# EAGLE schematic ACE1 (EAGLE 9.4.0)
Jupiter ACE Schematic drerived from Bobo Wensel with minor alterations and fixed V1.0 no edge connectors.
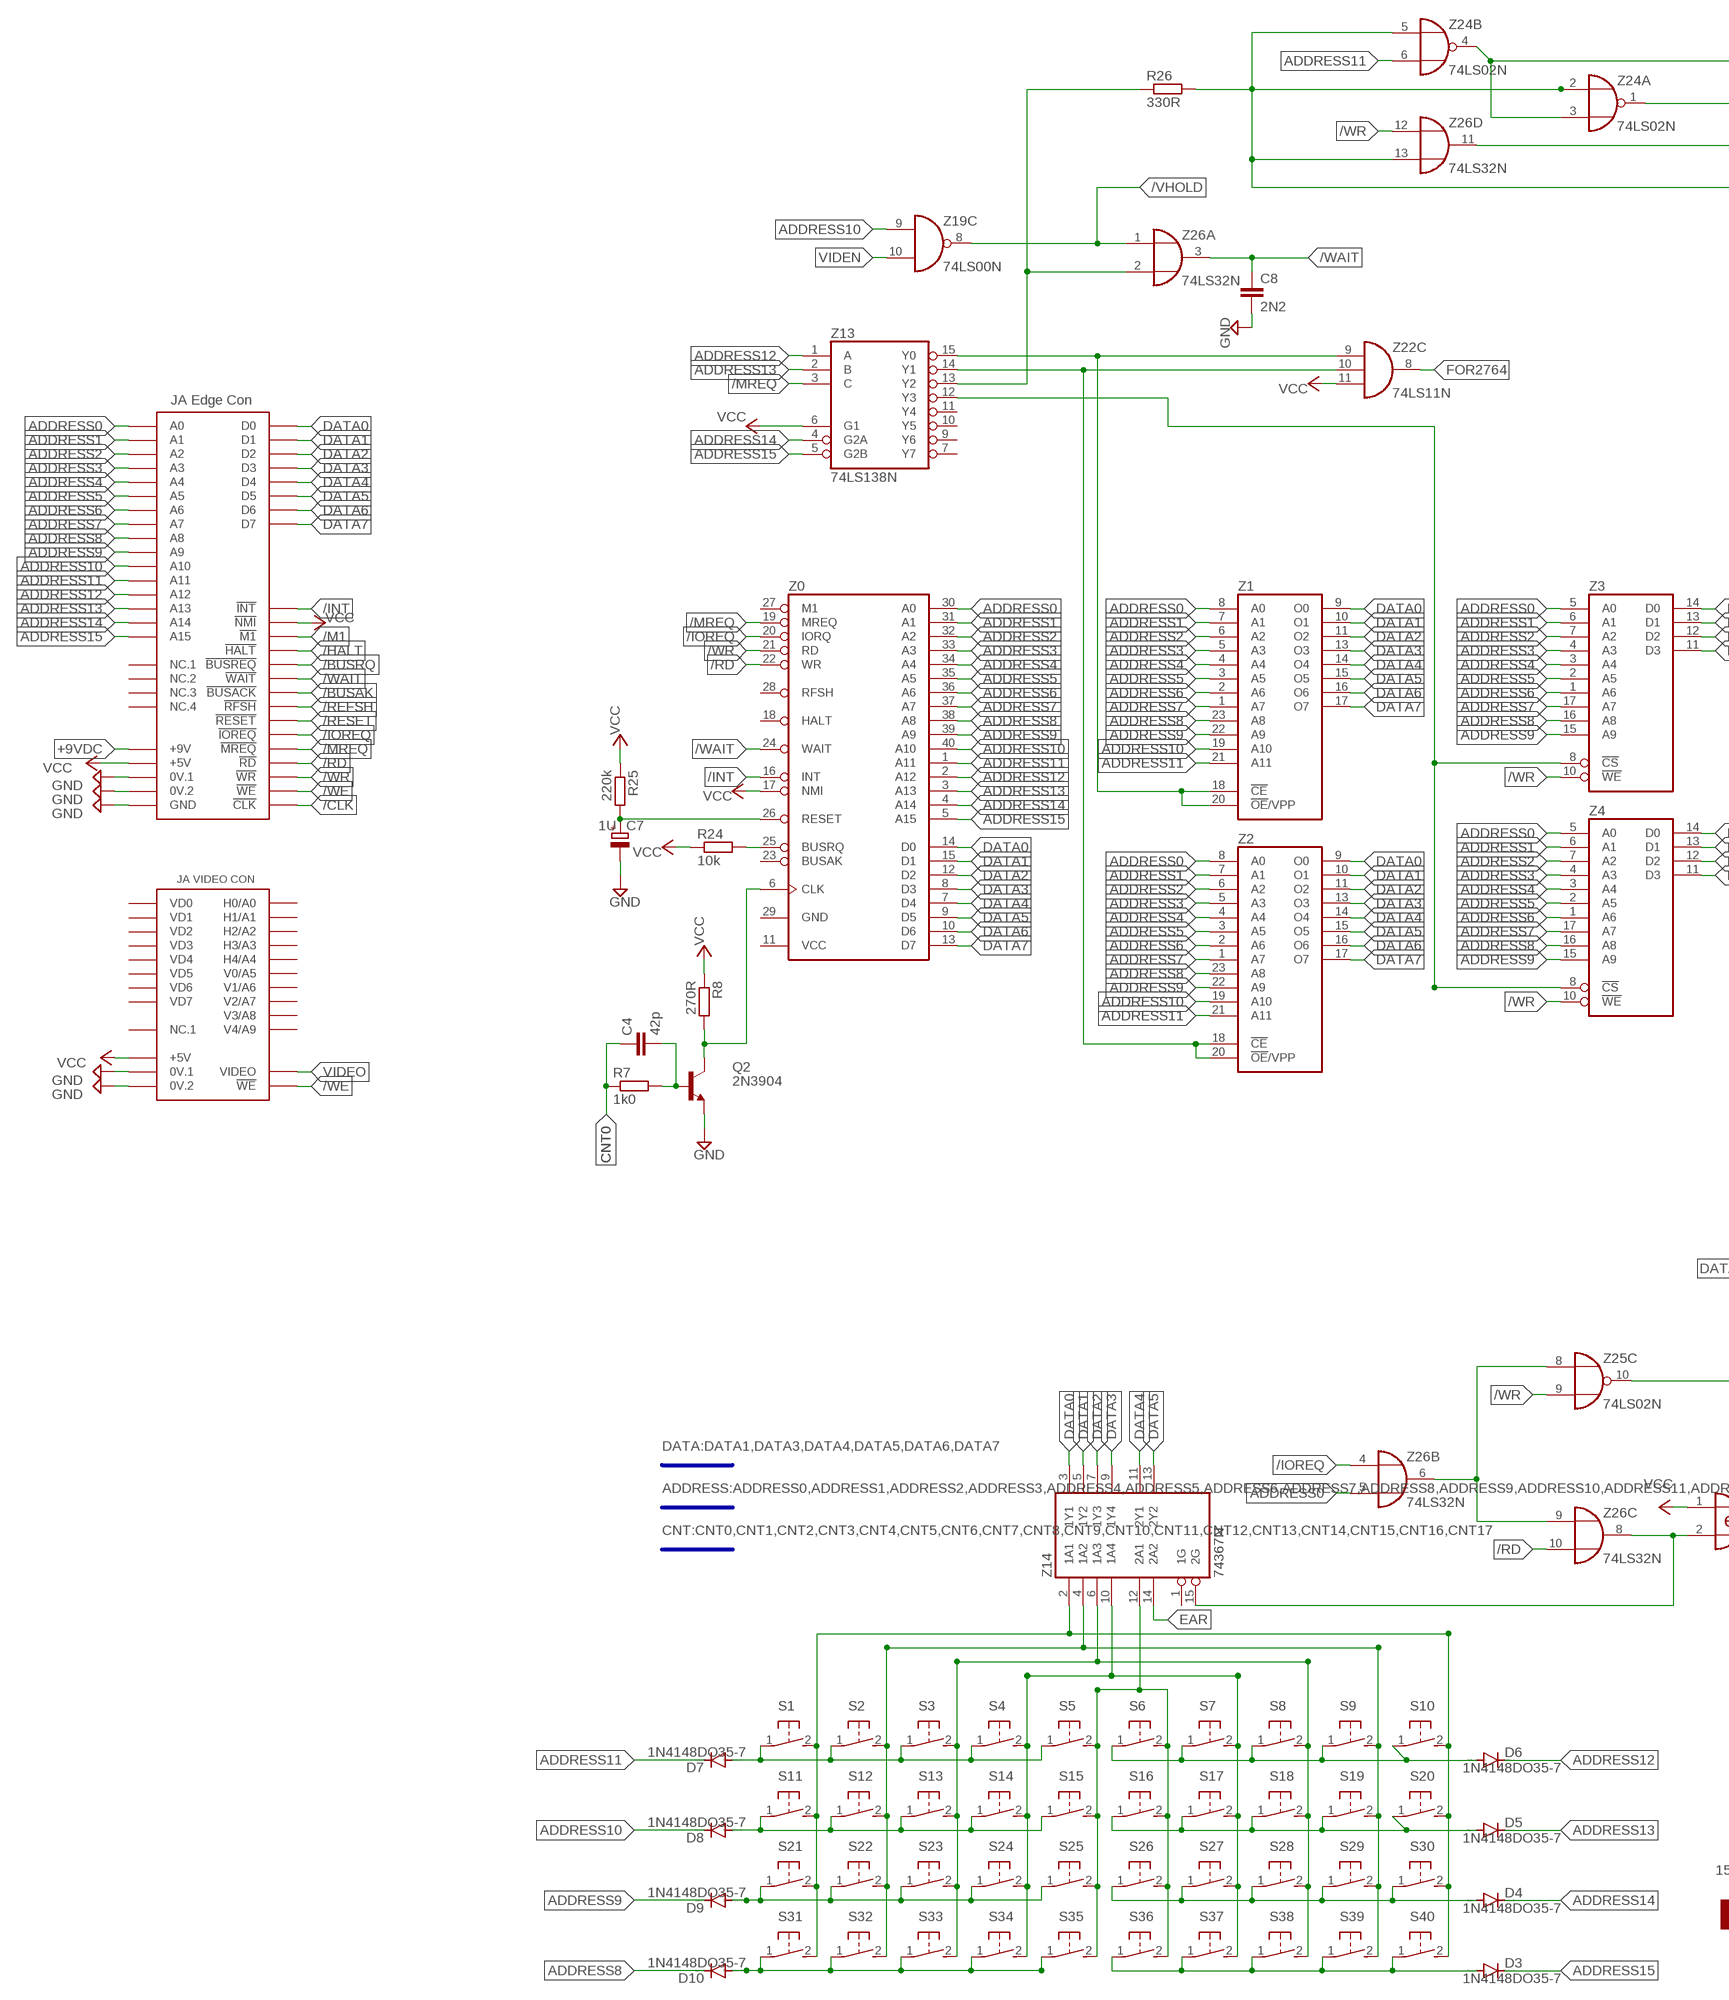
[diagram p0: schematic, sheet 1, part 1 of 2]
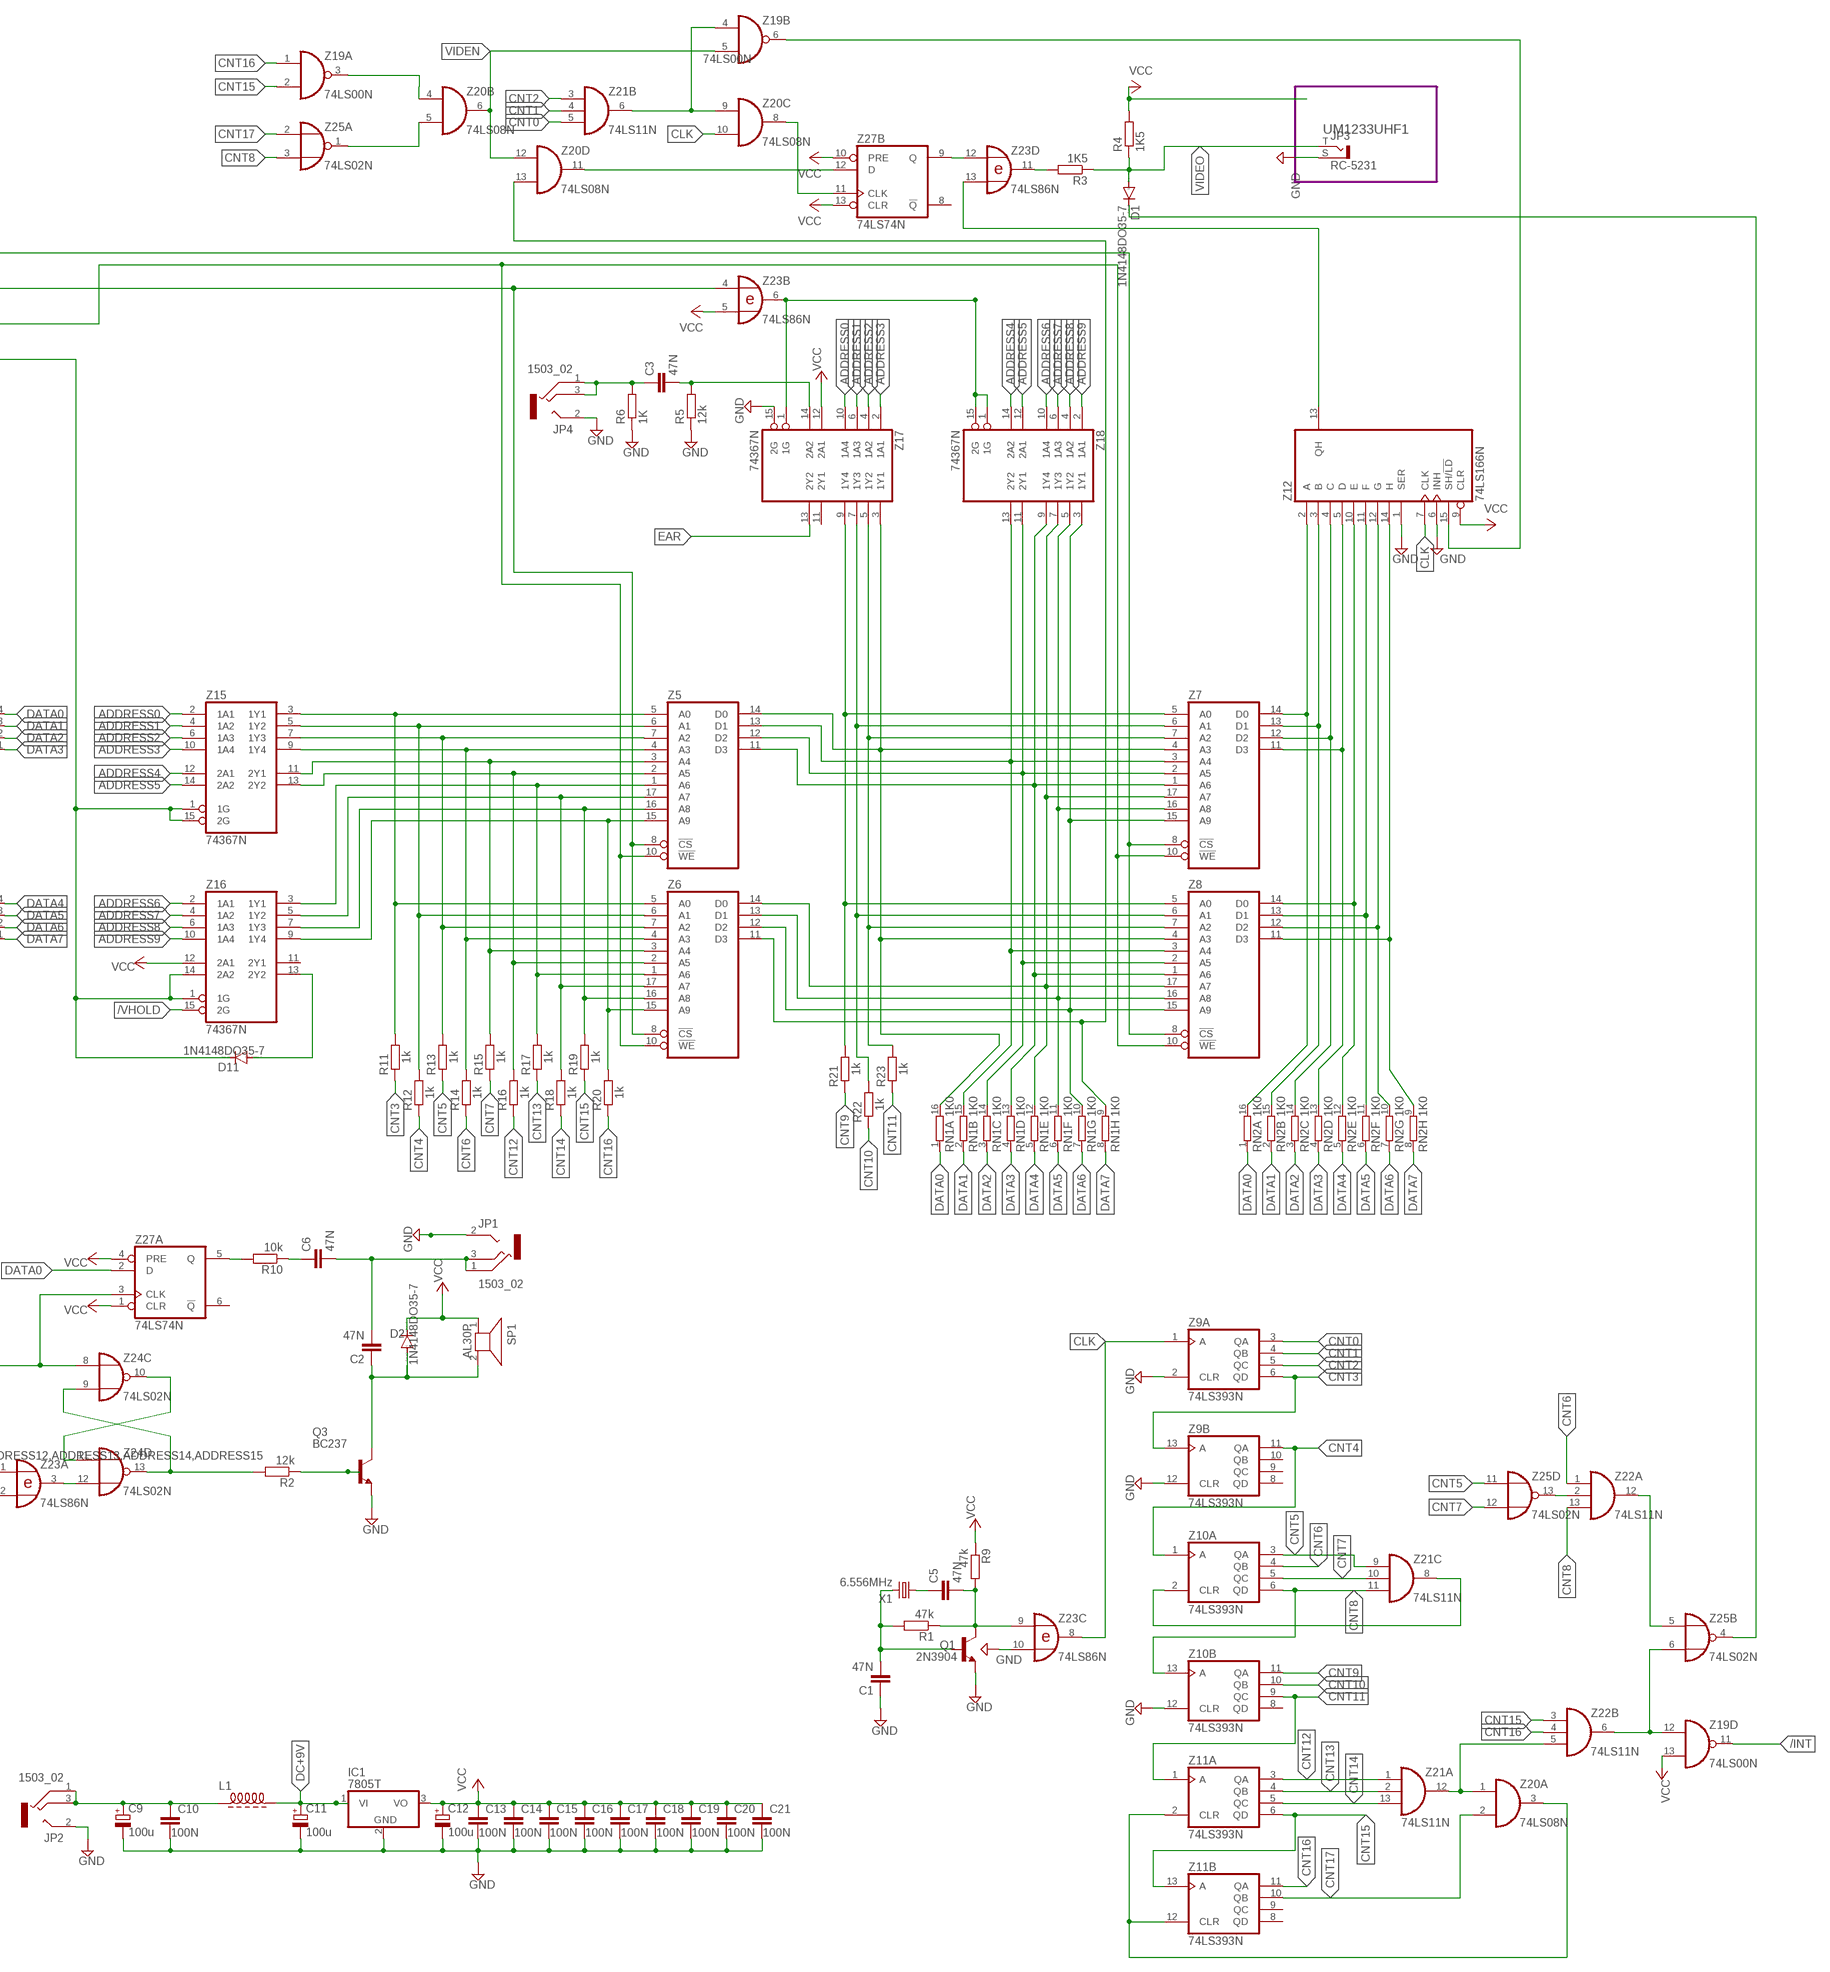
[diagram p1: schematic, sheet 1, part 2 of 2]

## Parts
C1  47N  C-EU025-024X044  [C025-024X044]
C2  47N  C-EU025-024X044  [C025-024X044]
C3  47N  C-EU025-024X044  [C025-024X044]
C4  42p  C-EU025-024X044  [C025-024X044]
C5  47N  C-EU025-024X044  [C025-024X044]
C6  47N  C-EU025-024X044  [C025-024X044]
C7  1U  CPOL-EUE5-5  [E5-5]
C8  2N2  C-EU025-024X044  [C025-024X044]
C9  100u  CPOL-EUE5-5  [E5-5]
C10  100N  C-EU025-024X044  [C025-024X044]
C11  100u  CPOL-EUE5-5  [E5-5]
C12  100u  CPOL-EUE5-5  [E5-5]
C13  100N  C-EU025-024X044  [C025-024X044]
C14  100N  C-EU025-024X044  [C025-024X044]
C15  100N  C-EU025-024X044  [C025-024X044]
C16  100N  C-EU025-024X044  [C025-024X044]
C17  100N  C-EU025-024X044  [C025-024X044]
C18  100N  C-EU025-024X044  [C025-024X044]
C19  100N  C-EU025-024X044  [C025-024X044]
C20  100N  C-EU025-024X044  [C025-024X044]
C21  100N  C-EU025-024X044  [C025-024X044]
D1  1N4148DO35-7  [DO35-7]
D2  1N4148DO35-7  [DO35-7]
D3  1N4148DO35-7  [DO35-7]
D4  1N4148DO35-7  [DO35-7]
D5  1N4148DO35-7  [DO35-7]
D6  1N4148DO35-7  [DO35-7]
D7  1N4148DO35-7  [DO35-7]
D8  1N4148DO35-7  [DO35-7]
D9  1N4148DO35-7  [DO35-7]
D10  1N4148DO35-7  [DO35-7]
D11  1N4148DO35-7  [DO35-7]
E1  EDG-CON-JA  [EDG-CON-JA]
E2  EDG-VID-JA  [EDG-VID-JA]
IC1  7805T  [TO220H]
JP1  1503_02  [1503_02]
JP2  1503_02  [1503_02]
JP3  RC-5231  [RC-5231]
JP4  1503_02  [1503_02]
L1  Z14/40CCW  [Z15/4]
Q1  2N3904  [TO92]
Q2  2N3904  [TO92]
Q3  BC237  [TO92]
R1  47k  R-EU_0207/2V  [0207/2V]
R2  12k  R-EU_0207/2V  [0207/2V]
R3  1K5  R-EU_0207/2V  [0207/2V]
R4  1K5  R-EU_0207/2V  [0207/2V]
R5  12k  R-EU_0207/2V  [0207/2V]
R6  1K  R-EU_0207/2V  [0207/2V]
R7  1k0  R-EU_0204/7  [0204/7]
R8  270R  R-EU_0207/2V  [0207/2V]
R9  47k  R-EU_0207/2V  [0207/2V]
R10  10k  R-EU_0207/2V  [0207/2V]
R11  1k  R-EU_0207/2V  [0207/2V]
R12  1k  R-EU_0207/2V  [0207/2V]
R13  1k  R-EU_0207/2V  [0207/2V]
R14  1k  R-EU_0207/2V  [0207/2V]
R15  1k  R-EU_0207/2V  [0207/2V]
R16  1k  R-EU_0207/2V  [0207/2V]
R17  1k  R-EU_0207/2V  [0207/2V]
R18  1k  R-EU_0207/2V  [0207/2V]
R19  1k  R-EU_0207/2V  [0207/2V]
R20  1k  R-EU_0207/2V  [0207/2V]
R21  1k  R-EU_0207/2V  [0207/2V]
R22  1k  R-EU_0207/2V  [0207/2V]
R23  1k  R-EU_0207/2V  [0207/2V]
R24  10k  R-EU_0207/2V  [0207/2V]
R25  220k  R-EU_0207/2V  [0207/2V]
R26  330R  R-EU_0204/7  [0204/7]
RN1  1K0  8R-N  [DIL16]
RN2  1K0  8R-N  [DIL16]
S1  31-XX  [B3F-31XX]
S2  31-XX  [B3F-31XX]
S3  31-XX  [B3F-31XX]
S4  31-XX  [B3F-31XX]
S5  31-XX  [B3F-31XX]
S6  31-XX  [B3F-31XX]
S7  31-XX  [B3F-31XX]
S8  31-XX  [B3F-31XX]
S9  31-XX  [B3F-31XX]
S10  31-XX  [B3F-31XX]
S11  31-XX  [B3F-31XX]
S12  31-XX  [B3F-31XX]
S13  31-XX  [B3F-31XX]
S14  31-XX  [B3F-31XX]
S15  31-XX  [B3F-31XX]
S16  31-XX  [B3F-31XX]
S17  31-XX  [B3F-31XX]
S18  31-XX  [B3F-31XX]
S19  31-XX  [B3F-31XX]
S20  31-XX  [B3F-31XX]
S21  31-XX  [B3F-31XX]
S22  31-XX  [B3F-31XX]
S23  31-XX  [B3F-31XX]
S24  31-XX  [B3F-31XX]
S25  31-XX  [B3F-31XX]
S26  31-XX  [B3F-31XX]
S27  31-XX  [B3F-31XX]
S28  31-XX  [B3F-31XX]
S29  31-XX  [B3F-31XX]
S30  31-XX  [B3F-31XX]
S31  31-XX  [B3F-31XX]
S32  31-XX  [B3F-31XX]
S33  31-XX  [B3F-31XX]
S34  31-XX  [B3F-31XX]
S35  31-XX  [B3F-31XX]
S36  31-XX  [B3F-31XX]
S37  31-XX  [B3F-31XX]
S38  31-XX  [B3F-31XX]
S39  31-XX  [B3F-31XX]
S40  31-XX  [B3F-31XX]
SP1  AL30P  [AL30P]
X1  6.556MHz  CRYSTALHC49U-V  [HC49U-V]
Z0  Z80CPU  [DIL40]
Z1  2732  [DIL24]
Z2  2732  [DIL24]
Z3  2114  [DIL18]
Z4  2114  [DIL18]
Z5  2114  [DIL18]
Z6  2114  [DIL18]
Z7  2114  [DIL18]
Z8  2114  [DIL18]
Z9  74LS393N  [DIL14]
Z10  74LS393N  [DIL14]
Z11  74LS393N  [DIL14]
Z12  74LS166N  [DIL16]
Z13  74LS138N  [DIL16]
Z14  74367N  [DIL16]
Z15  74367N  [DIL16]
Z16  74367N  [DIL16]
Z17  74367N  [DIL16]
Z18  74367N  [DIL16]
Z19  74LS00N  [DIL14]
Z20  74LS08N  [DIL14]
Z21  74LS11N  [DIL14]
Z22  74LS11N  [DIL14]
Z23  74LS86N  [DIL14]
Z24  74LS02N  [DIL14]
Z25  74LS02N  [DIL14]
Z26  74LS32N  [DIL14]
Z27  74LS74N  [DIL14]

## Module instances
UM1233UHF1 = UM1233UHF

## Nets
+9VDC: E1.+9V
/BUSAK: E1.BUSACK(!BUSACK)
/BUSRQ: E1.BUSREQ(!BUSREQ)
/CLK: E1.CLK(!CLK)
/HALT: E1.HALT(!HALT)
/INT: E1.INT(!INT) Z0.16(INT) Z19.11(D:O)
/IOREQ: E1.IOREQ(!IOREQ) Z0.20(IORQ) Z26.4(B:I0)
/M1: E1.M1(!M1)
/MREQ: E1.MREQ(!MREQ) Z0.19(MREQ) Z13.3(C)
/RD: E1.RD(!RD) Z0.22(WR) Z26.10(C:I1)
/REFSH: E1.RFSH(!RFSH)
/RESET: E1.RESET(!RESET)
/VHOLD: Z16.15(2G) Z19.8(C:O) Z26.1(A:I0)
/WAIT: C8.1 E1.WAIT(!WAIT) Z0.24(WAIT) Z26.3(A:O)
/WE: E1.WE(!WE) E2.WE(!WE!)
/WR: E1.WR(!WR) Z0.21(RD) Z3.10(!WE) Z4.10(!WE) Z25.9(C:I1) Z26.12(D:I0)
ADDRESS0: E1.A0 Z0.30(A0) Z1.8(A0) Z2.8(A0) Z3.5(A0) Z4.5(A0) Z15.2(1A1) Z17.10(1A4) Z26.5(B:I1)
ADDRESS1: E1.A1 Z0.31(A1) Z1.7(A1) Z2.7(A1) Z3.6(A1) Z4.6(A1) Z15.4(1A2) Z17.6(1A3)
ADDRESS2: E1.A2 Z0.32(A2) Z1.6(A2) Z2.6(A2) Z3.7(A2) Z4.7(A2) Z15.6(1A3) Z17.4(1A2)
ADDRESS3: E1.A3 Z0.33(A3) Z1.5(A3) Z2.5(A3) Z3.4(A3) Z4.4(A3) Z15.10(1A4) Z17.2(1A1)
ADDRESS4: E1.A4 Z0.34(A4) Z1.4(A4) Z2.4(A4) Z3.3(A4) Z4.3(A4) Z15.12(2A1) Z18.14(2A2)
ADDRESS5: E1.A5 Z0.35(A5) Z1.3(A5) Z2.3(A5) Z3.2(A5) Z4.2(A5) Z15.14(2A2) Z18.12(2A1)
ADDRESS6: E1.A6 Z0.36(A6) Z1.2(A6) Z2.2(A6) Z3.1(A6) Z4.1(A6) Z16.2(1A1) Z18.10(1A4)
ADDRESS7: E1.A7 Z0.37(A7) Z1.1(A7) Z2.1(A7) Z3.17(A7) Z4.17(A7) Z16.4(1A2) Z18.6(1A3)
ADDRESS8: D10.C E1.A8 Z0.38(A8) Z1.23(A8) Z2.23(A8) Z3.16(A8) Z4.16(A8) Z16.6(1A3) Z18.4(1A2)
ADDRESS9: D9.C E1.A9 Z0.39(A9) Z1.22(A9) Z2.22(A9) Z3.15(A9) Z4.15(A9) Z16.10(1A4) Z18.2(1A1)
ADDRESS10: D8.C E1.A10 Z0.40(A10) Z1.19(A10) Z2.19(A10) Z19.9(C:I0)
ADDRESS11: D7.C E1.A11 Z0.1(A11) Z1.21(A11) Z2.21(A11) Z24.6(B:I1)
ADDRESS12: D6.C E1.A12 Z0.2(A12) Z13.1(A)
ADDRESS13: D5.C E1.A13 Z0.3(A13) Z13.2(B)
ADDRESS14: D4.C E1.A14 Z0.4(A14) Z13.4(G2A)
ADDRESS15: D3.C E1.A15 Z0.5(A15) Z13.5(G2B)
CLK: Z9.1(A:A) Z12.7(CLK) Z20.10(C:I1) Z23.8(C:O)
CNT0: C4.1 R7.1 Z9.3(A:QA) Z21.5(B:I2)
CNT1: Z9.4(A:QB) Z21.4(B:I1)
CNT2: Z9.5(A:QC) Z21.3(B:I0)
CNT3: R11.1 Z9.6(A:QD) Z9.13(B:A)
CNT4: R12.1 Z9.11(B:QA) Z10.1(A:A)
CNT5: R13.1 Z10.3(A:QA) Z21.9(C:I0) Z25.11(D:I0)
CNT6: R14.1 Z10.4(A:QB) Z22.1(A:I0)
CNT7: R15.1 Z10.5(A:QC) Z21.10(C:I1) Z25.12(D:I1)
CNT8: Z10.6(A:QD) Z10.13(B:A) Z21.11(C:I2) Z22.13(A:I2) Z25.3(A:I1)
CNT9: R21.1 Z10.11(B:QA)
CNT10: R22.1 Z10.10(B:QB)
CNT11: R23.1 Z10.9(B:QC) Z11.1(A:A)
CNT12: R16.1 Z11.3(A:QA) Z21.1(A:I0)
CNT13: R17.1 Z11.4(A:QB) Z21.2(A:I1)
CNT14: R18.1 Z11.5(A:QC) Z21.13(A:I2)
CNT15: R19.1 Z11.6(A:QD) Z11.13(B:A) Z19.2(A:I1) Z22.3(B:I0)
CNT16: R20.1 Z11.11(B:QA) Z19.1(A:I0) Z22.4(B:I1)
CNT17: Z11.10(B:QB) Z20.2(A:I1) Z25.2(A:I0)
DATA0: E1.D0 RN1.1 RN2.1 Z0.14(D0) Z1.9(O0) Z2.9(O0) Z3.14(D0) Z14.3(1Y1) Z27.2(A:D)
DATA1: E1.D1 RN1.2 RN2.2 Z0.15(D1) Z1.10(O1) Z2.10(O1) Z3.13(D1) Z14.5(1Y2)
DATA2: E1.D2 RN1.3 RN2.3 Z0.12(D2) Z1.11(O2) Z2.11(O2) Z3.12(D2) Z14.7(1Y3)
DATA3: E1.D3 RN1.4 RN2.4 Z0.8(D3) Z1.13(O3) Z2.13(O3) Z3.11(D3) Z14.9(1Y4)
DATA4: E1.D4 RN1.5 RN2.5 Z0.7(D4) Z1.14(O4) Z2.14(O4) Z4.14(D0) Z14.11(2Y1)
DATA5: E1.D5 RN1.6 RN2.6 Z0.9(D5) Z1.15(O5) Z2.15(O5) Z4.13(D1) Z14.13(2Y2)
DATA6: E1.D6 RN1.7 RN2.7 Z0.10(D6) Z1.16(O6) Z2.16(O6) Z4.12(D2)
DATA7: E1.D7 RN1.8 RN2.8 Z0.13(D7) Z1.17(O7) Z2.17(O7) Z4.11(D3)
DC+9V: C11.+ IC1.1(VI) L1.2
EAR: Z14.14(2A2) Z17.13(2Y2)
FOR2764: Z22.8(C:O)
GND: C1.1 C7.- C8.2 C9.- C10.1 C11.- C12.- C13.1 C14.1 C15.1 C16.1 C17.1 C18.1 C19.1 C20.1 C21.1 E1.0V.1 E1.GND E1.V0.2(0V.2) E2.0V.1 E2.0V.2 IC1.2(GND) JP1.2 JP2.2 JP3.S JP4.2 Q1.3(E) Q2.3(E) Q3.1(E) R5.1 R6.1 Z9.2(A:CLR) Z9.12(B:CLR) Z10.12(B:CLR) Z12.1(SER) Z12.6(INH) Z17.15(2G) Z23.10(C:I1)
N$1: Z1.18(!CE) Z1.20(!OE!/VPP) Z13.15(Y0) Z22.9(C:I0)
N$2: R26.1 Z13.13(Y2) Z26.2(A:I1)
N$3: Z2.18(!CE) Z2.20(!OE!/VPP) Z13.14(Y1) Z22.10(C:I1)
N$4: C3.2 R5.2 Z17.14(2A2)
N$5: R11.2 Z5.5(A0) Z6.5(A0) Z15.3(1Y1)
N$6: Z7.8(!CS) Z8.8(!CS) Z24.3(A:I1) Z24.4(B:O)
N$7: Z5.8(!CS) Z6.8(!CS) Z23.4(B:I0) Z24.1(A:O)
N$8: Z5.10(!WE) Z6.10(!WE) Z7.10(!WE) Z8.10(!WE) Z26.11(D:O)
N$9: Z14.1(1G)
N$10: Z19.3(A:O) Z20.4(B:I0)
N$11: Z20.5(B:I1) Z25.1(A:O)
N$12: C3.1 JP4.1 JP4.3 R6.2
N$13: R12.2 Z5.6(A1) Z6.6(A1) Z15.5(1Y2)
N$14: Z20.11(D:O) Z27.12(B:D)
N$15: Z20.8(C:O) Z27.11(B:CLK)
N$17: Z23.12(D:I0) Z27.9(B:Q)
N$18: Z12.13(QH) Z23.13(D:I1)
N$19: R3.2 Z23.11(D:O)
N$21: Z17.1(1G) Z18.1(1G) Z18.15(2G) Z23.6(B:O)
N$22: Z12.15(SH/!LD) Z19.6(B:O)
N$23: C7.+ R25.2 Z0.26(RESET)
N$24: Q2.1(C) R8.2 Z0.6(CLK)
N$25: R24.2 Z0.25(BUSRQ)
N$26: C4.2 Q2.2(B) R7.2
N$27: Z19.4(B:I0) Z20.9(C:I0) Z21.6(B:O)
N$28: Z3.8(!CS) Z4.8(!CS) Z13.12(Y3)
N$29: Z14.15(2G) Z23.2(A:I1) Z26.8(C:O)
N$30: R13.2 Z5.7(A2) Z6.7(A2) Z15.7(1Y3)
N$31: Z25.8(C:I0) Z26.6(B:O) Z26.9(C:I0)
N$32: R14.2 Z5.4(A3) Z6.4(A3) Z15.9(1Y4)
N$33: C5.2 Q1.1(C) R1.1 R9.2 Z23.9(C:I0)
N$34: Z24.10(C:O) Z24.11(D:I0)
N$35: Z24.8(C:I0) Z25.10(C:O) Z27.3(A:CLK)
N$36: C5.1 X1.1
N$37: R15.2 Z5.3(A4) Z6.3(A4) Z15.11(2Y1)
N$38: R2.2 Z24.9(C:I1) Z24.13(D:O)
N$39: Z23.3(A:O) Z24.12(D:I1)
N$40: Q3.2(B) R2.1
N$41: R10.2 Z27.5(A:Q)
N$42: C6.1 R10.1
N$43: C2.2 C6.2 JP1.1 JP1.3
N$44: C2.1 D2.A Q3.3(C) SP1.2
N$45: R16.2 Z5.2(A5) Z6.2(A5) Z15.13(2Y2)
N$46: R17.2 Z5.1(A6) Z6.1(A6) Z16.3(1Y1)
N$47: C1.2 Q1.2(B) R1.2 X1.2
N$48: R18.2 Z5.17(A7) Z6.17(A7) Z16.5(1Y2)
N$49: Z20.1(A:I0) Z21.12(A:O) Z22.5(B:I2)
N$50: Z19.12(D:I0) Z22.6(B:O) Z25.6(B:I1)
N$51: D1.C Z25.4(B:O)
N$52: Z22.2(A:I1) Z25.13(D:O)
N$53: D7.A S1.1(P) S2.1(P) S3.1(P) S4.1(P) S5.1(P)
N$54: Z10.2(A:CLR) Z21.8(C:O)
N$55: Z11.2(A:CLR) Z11.12(B:CLR) Z20.3(A:O)
N$56: S1.2(S) S10.2(S) S11.2(S) S20.2(S) S21.2(S) S30.2(S) S31.2(S) S40.2(S) Z14.2(1A1)
N$57: D8.A S11.1(P) S12.1(P) S13.1(P) S14.1(P) S15.1(P)
N$58: D9.A S21.1(P) S22.1(P) S23.1(P) S24.1(P) S25.1(P)
N$59: Z22.12(A:O) Z25.5(B:I0)
N$60: D10.A S31.1(P) S32.1(P) S33.1(P) S34.1(P) S35.1(P)
N$61: S3.2(S) S8.2(S) S13.2(S) S18.2(S) S23.2(S) S28.2(S) S33.2(S) S38.2(S) Z14.6(1A3)
N$62: S4.2(S) S7.2(S) S14.2(S) S17.2(S) S24.2(S) S27.2(S) S34.2(S) S37.2(S) Z14.10(1A4)
N$63: S2.2(S) S9.2(S) S12.2(S) S19.2(S) S22.2(S) S29.2(S) S32.2(S) S39.2(S) Z14.4(1A2)
N$64: S5.2(S) S6.2(S) S15.2(S) S16.2(S) S25.2(S) S26.2(S) S35.2(S) S36.2(S) Z14.12(2A1)
N$65: C9.+ C10.2 JP2.1 JP2.3 L1.1
N$67: R19.2 Z5.16(A8) Z6.16(A8) Z16.7(1Y3)
N$68: R20.2 Z5.15(A9) Z6.15(A9) Z16.9(1Y4)
N$69: D11.A Z16.13(2Y2)
N$70: RN1.9 Z6.11(D3) Z20.13(D:I1)
N$71: R21.2 Z7.5(A0) Z8.5(A0) Z17.9(1Y4)
N$73: R22.2 Z7.6(A1) Z8.6(A1) Z17.7(1Y3)
N$74: R23.2 Z7.7(A2) Z8.7(A2) Z17.5(1Y2)
N$75: RN1.16 Z5.14(D0) Z7.4(A3) Z8.4(A3) Z17.3(1Y1)
N$76: RN1.15 Z5.13(D1) Z7.3(A4) Z8.3(A4) Z18.13(2Y2)
N$77: D6.A S6.1(P) S7.1(P) S8.1(P) S9.1(P) S10.1(P)
N$78: D5.A S16.1(P) S17.1(P) S18.1(P) S19.1(P) S20.1(P)
N$79: D4.A S26.1(P) S27.1(P) S28.1(P) S29.1(P) S30.1(P)
N$80: D3.A S36.1(P) S37.1(P) S38.1(P) S39.1(P) S40.1(P)
N$81: RN1.14 Z5.12(D2) Z7.2(A5) Z8.2(A5) Z18.11(2Y1)
N$82: RN1.13 Z5.11(D3) Z7.1(A6) Z8.1(A6) Z18.9(1Y4)
N$83: RN1.12 Z6.14(D0) Z7.17(A7) Z8.17(A7) Z18.7(1Y3)
N$84: RN1.11 Z6.13(D1) Z7.16(A8) Z8.16(A8) Z18.5(1Y2)
N$85: RN1.10 Z6.12(D2) Z7.15(A9) Z8.15(A9) Z18.3(1Y1)
N$86: D11.C R26.2 Z15.1(1G) Z15.15(2G) Z16.1(1G) Z16.14(2A2) Z24.2(A:I0) Z24.5(B:I0) Z26.13(D:I1)
N$90: RN2.9 Z8.11(D3) Z12.14(H)
N$91: RN2.16 Z7.14(D0) Z12.2(A)
N$92: RN2.15 Z7.13(D1) Z12.3(B)
N$93: RN2.14 Z7.12(D2) Z12.4(C)
N$94: RN2.13 Z7.11(D3) Z12.5(D)
N$95: RN2.12 Z8.14(D0) Z12.10(E)
N$96: RN2.11 Z8.13(D1) Z12.11(F)
N$97: RN2.10 Z8.12(D2) Z12.12(G)
VCC: C12.+ C13.2 C14.2 C15.2 C16.2 C17.2 C18.2 C19.2 C20.2 C21.2 D2.C E1.+5V E1.NMI(!NMI) E2.+5V IC1.3(VO) R4.2 R8.1 R9.1 R24.1 R25.1 SP1.1 Z0.17(NMI) Z12.9(CLR) Z13.6(G1) Z16.12(2A1) Z17.12(2A1) Z19.13(D:I1) Z22.11(C:I2) Z23.1(A:I0) Z23.5(B:I1) Z27.1(A:CLR) Z27.4(A:PRE) Z27.10(B:PRE) Z27.13(B:CLR)
VIDEN: Z19.5(B:I1) Z19.10(C:I1) Z20.6(B:O) Z20.12(D:I0)
VIDEO: D1.A E2.VIDEO JP3.T R3.1 R4.1
Unconnected: E1.N.C.1(NC.1) E1.N.C.2(NC.2) E1.N.C.3(NC.3) E1.N.C.4(NC.4) E2.H0/A0 E2.H1/A1 E2.H2/A2 E2.H3/A3 E2.H4/A4 E2.N.C.(NC.1) E2.V0/A5 E2.V1/A6 E2.V2/A7 E2.V3/A8 E2.V4/A9 E2.VD0 E2.VD1 E2.VD2 E2.VD3 E2.VD4 E2.VD5 E2.VD6 E2.VD7 JP1.2@2 JP2.2@2 JP4.2@2 Z0.18(HALT) Z0.23(BUSAK) Z0.27(M1) Z0.28(RFSH) Z9.8(B:QD) Z9.9(B:QC) Z9.10(B:QB) Z10.8(B:QD) Z11.8(B:QD) Z11.9(B:QC) Z13.7(Y7) Z13.9(Y6) Z13.10(Y5) Z13.11(Y4) Z16.11(2Y1) Z17.11(2Y1) Z27.6(A:!Q) Z27.8(B:!Q)

## Buses
ADDRESS:ADDRESS0,ADDRESS1,ADDRESS2,ADDRESS3,ADDRESS4,ADDRESS5,ADDRESS6,ADDRESS7,ADDRESS8,ADDRESS9,ADDRESS10,ADDRESS11,ADDRESS12,ADDRESS13,ADDRESS14,ADDRESS15
DATA:DATA1,DATA3,DATA4,DATA5,DATA6,DATA7
CNT:CNT0,CNT1,CNT2,CNT3,CNT4,CNT5,CNT6,CNT7,CNT8,CNT9,CNT10,CNT11,CNT12,CNT13,CNT14,CNT15,CNT16,CNT17

## Power pins joined to a net without a drawn wire
GND: Z0.29(GND) Z1.12(GND) Z2.12(GND) Z3.9(GND) Z4.9(GND) Z5.9(GND) Z6.9(GND) Z7.9(GND) Z8.9(GND) Z9.7(P:GND) Z10.7(P:GND) Z11.7(P:GND) Z12.8(GND) Z13.8(GND) Z14.8(GND) Z15.8(GND) Z16.8(GND) Z17.8(GND) Z18.8(GND) Z19.7(P:GND) Z20.7(P:GND) Z21.7(P:GND) Z22.7(P:GND) Z23.7(P:GND) Z24.7(P:GND) Z25.7(P:GND) Z26.7(P:GND) Z27.7(P:GND)
VCC: Z0.11(VCC) Z1.24(VCC) Z2.24(VCC) Z3.18(VCC) Z4.18(VCC) Z5.18(VCC) Z6.18(VCC) Z7.18(VCC) Z8.18(VCC) Z9.14(P:VCC) Z10.14(P:VCC) Z11.14(P:VCC) Z12.16(VCC) Z13.16(VCC) Z14.16(VCC) Z15.16(VCC) Z16.16(VCC) Z17.16(VCC) Z18.16(VCC) Z19.14(P:VCC) Z20.14(P:VCC) Z21.14(P:VCC) Z22.14(P:VCC) Z23.14(P:VCC) Z24.14(P:VCC) Z25.14(P:VCC) Z26.14(P:VCC) Z27.14(P:VCC)

## Library data of the parts
C1-C6 C8 C10 C13-C21 = rcl:C-EU: CAPACITOR, European symbol; SPICEPREFIX: C
C7 C9 C11 C12 = rcl:CPOL-EU: POLARIZED CAPACITOR, European symbol; SPICEPREFIX: C
D1-D11 = diode:1N4148: DIODE high speed (Philips)
E1 = Jupiter-ace-2015.3:EDG-CON-JA: EDG-BOTH-JA - Jupiter ACE Forth Expansion For more details see Jupiter ACE Archive - www.jupiter-ace.co.uk <http://www.jupiter-ace.co.uk/hardware_pinouts.html> Technical Specifications: Power +9, +5v, 800 mA Pad size 1.7 x 8mm Expansion Port Version 2015.1 SPT/EB
E2 = Jupiter-ace-2015.3:EDG-VID-JA: EDG-BOTH-JA - Jupiter ACE Forth Video Ports For more details see Jupiter ACE Archive - www.jupiter-ace.co.uk <http://www.jupiter-ace.co.uk/hardware_pinouts.html> Technical Specifications: Power +5v, 800 mA Pad size 1.7 x 8mm Video Port Version 2015.1 SPT/EB
IC1 = linear:78*: Positive VOLTAGE REGULATOR Source: http://cache.national.com/ds/LM/LM78L05.pdf http://www.fairchildsemi.com/ds/LM/LM7805.pdf
JP1 JP2 JP4 = con-lumberg:1503_02: Jack connectors according to JISC 6560, 3.5 mm Klinkeneinbaukupplung nach JISC 6560, 3,5 mm, 3-polig/stereo, abgewinkelte Ausführung, Surface-Mount-Technik (SMT) Source: http://www.lumberg.com/Produkte/PDFs/1503_02.pdf; OC_FARNELL: 1216979; OC_NEWARK: unknown
JP3 = con-lumberg:RC-5231: RCA connectors according to JEITA RC-5231 RCA-Steckverbinder nach JEITA RC-5231 Source: RCA- Stecker 2poolig.pdf
L1 = inductor-neosid:Z?CCW: CHOKE free-suspension choke/nominal inductance winding counter clockwise; OC_FARNELL: unknown; OC_NEWARK: unknown
Q1 Q2 = transistor:2N3904: NPN TRANSISTOR
Q3 = transistor:BC237: NPN TRANSISTOR
R1-R26 = rcl:R-EU_: RESISTOR, European symbol; SPICEPREFIX: R
RN1 RN2 = resistor-dil:8R-N: DIL RESISTOR; OC_FARNELL: unknown; OC_NEWARK: unknown
S1-S40 = switch-omron:31-XX: OMRON SWITCH; MPN: B3F-3100; OC_FARNELL: 959704; OC_NEWARK: 36M3582
SP1 = buzzer:AL30P: SPEAKER Source: Buerklin; OC_FARNELL: unknown; OC_NEWARK: unknown
X1 = crystal:CRYSTAL: CRYSTAL; OC_FARNELL: 1666969; OC_NEWARK: unknown
Z0 = zilog:Z80CPU: Z80 FAMILY DEVICE
Z1 Z2 = memory:2732: MEMORY
Z3-Z8 = memory:2114: MEMORY
Z9-Z11 = 74xx-eu:74*393: Dual 4-bit decade and binary COUNTER
Z12 = 74xx-eu:74*166: 8-bit parallel load SHIFT REGISTER
Z13 = 74xx-eu:74*138: 3-line to 8-line DECODER/DEMULTIPLEXER
Z14-Z18 = 74xx-eu:74*367: Hex BUS DRIVER, 3-state
Z19 = 74xx-eu:74*00: Quad 2-input NAND gate
Z20 = 74xx-eu:74*08: Quad 2-input AND gate
Z21 Z22 = 74xx-eu:74*11: Triple 3-input AND gate
Z23 = 74xx-eu:74*86: Quad 2-input EXCLUSIVE-OR (XOR) gate
Z24 Z25 = 74xx-eu:74*02: Quad 2-input NOR gate
Z26 = 74xx-eu:74*32: Quad 2-input OR gate
Z27 = 74xx-eu:74*74: Dual D type positive edge triggered FLIP FLOP, preset and clear

## Module UM1233UHF
Ports: 

### Library data of the parts